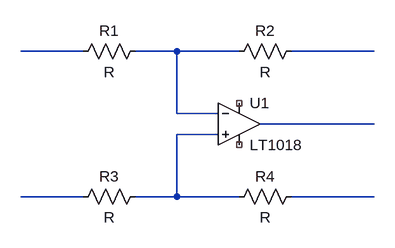
[diagram p0: schematic HW 3 #2.asc]
HW 3 #2.asc, the LTspice schematic file:
Version 4
SHEET 1 880 680
WIRE 16 96 -80 96
WIRE 160 96 96 96
WIRE 256 96 160 96
WIRE 464 96 336 96
WIRE 160 192 160 96
WIRE 224 192 160 192
WIRE 464 208 288 208
WIRE 224 224 160 224
WIRE 16 320 -80 320
WIRE 160 320 160 224
WIRE 160 320 96 320
WIRE 256 320 160 320
WIRE 464 320 336 320
SYMBOL res 112 80 R90
WINDOW 0 0 56 VBottom 2
WINDOW 3 32 56 VTop 2
SYMATTR InstName R1
SYMBOL res 352 80 R90
WINDOW 0 0 56 VBottom 2
WINDOW 3 32 56 VTop 2
SYMATTR InstName R2
SYMBOL res 112 304 R90
WINDOW 0 0 56 VBottom 2
WINDOW 3 32 56 VTop 2
SYMATTR InstName R3
SYMBOL res 352 304 R90
WINDOW 0 0 56 VBottom 2
WINDOW 3 32 56 VTop 2
SYMATTR InstName R4
SYMBOL Comparators\\LT1018 256 208 R0
SYMATTR InstName U1

The netlist it stands for:
* HW 3 #2.asc
R1 N002 N001 R
R2 N003 N002 R
R3 N005 N006 R
R4 N007 N005 R
XU1 N005 N002 NC_01 NC_02 N004 LT1018  ; pins In+ In- V+ V- OUT
.lib LTC1.lib
.backanno
.end